# EAGLE design TBX01 (EAGLE 7.3.0)
CNAME: Test
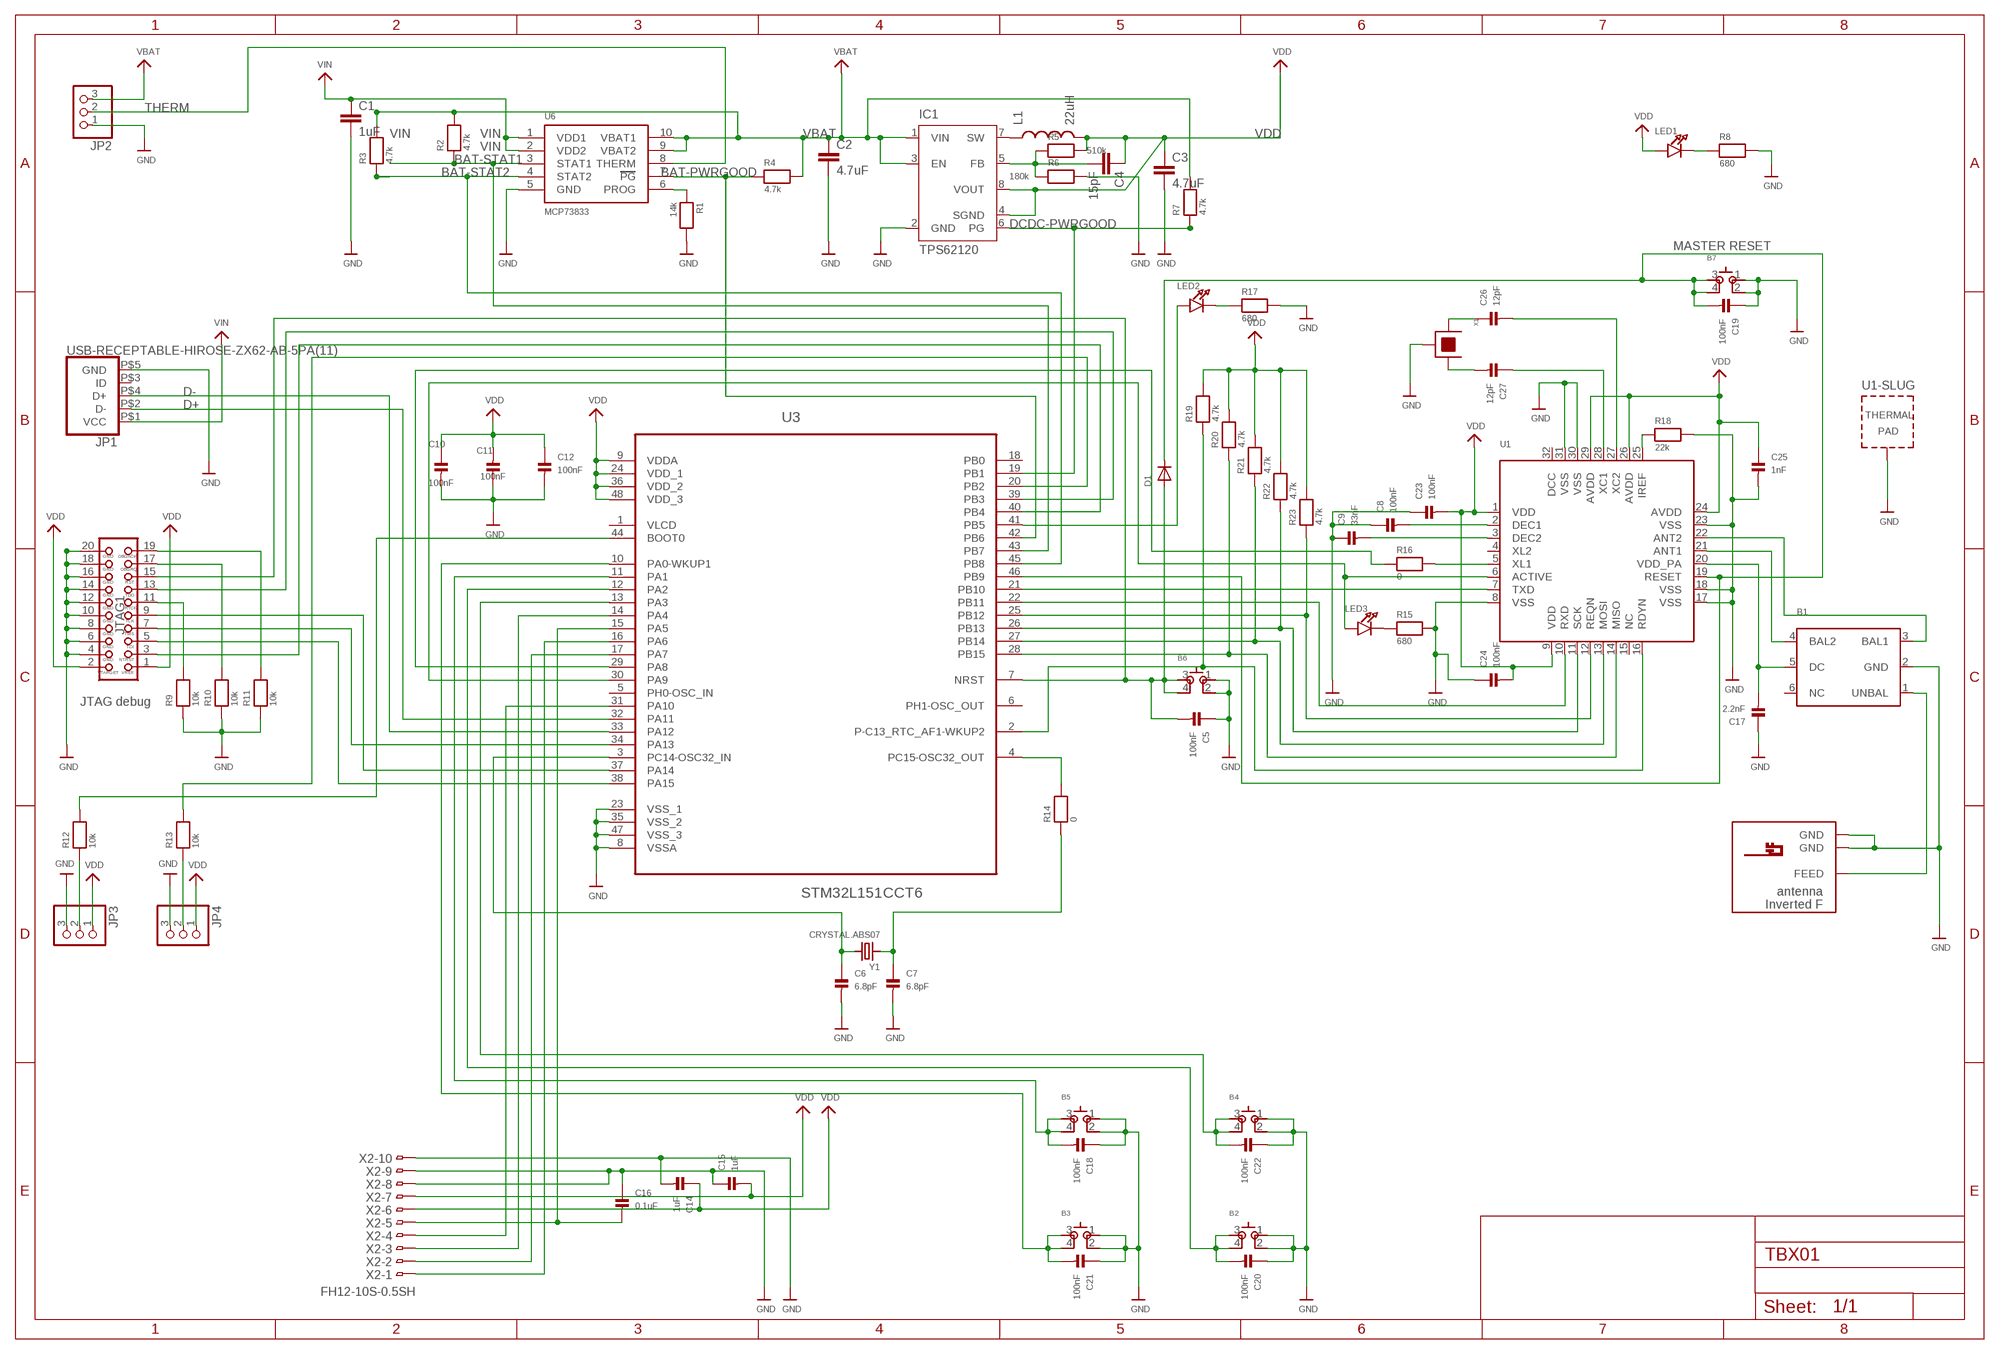
[diagram p0: schematic, sheet 1]

## Parts
B1  BALUN+LP_NORDIC  [BALUN0603]
B2  SKSCLDE010  [SKSCLDE010]
B3  SKSCLDE010  [SKSCLDE010]
B4  SKSCLDE010  [SKSCLDE010]
B5  SKSCLDE010  [SKSCLDE010]
B6  SKSCLDE010  [SKSCLDE010]
B7  SKSCLDE010  [SKSCLDE010]
C1  1uF  C-EUC0603  [C0603]
C2  4.7uF  C-EUC0603  [C0603]
C3  4.7uF  C-EUC0603  [C0603]
C4  15pF  C-EUC0603  [C0603]
C5  100nF  CAP_CERAMIC0603  [0603]
C6  6.8pF  CAP_CERAMIC0603  [0603]
C7  6.8pF  CAP_CERAMIC0603  [0603]
C8  100nF  CAP_CERAMIC0603  [0603]
C9  33nF  CAP_CERAMIC0603  [0603]
C10  100nF  CAP_CERAMIC0603  [0603]
C11  100nF  CAP_CERAMIC0603  [0603]
C12  100nF  CAP_CERAMIC0603  [0603]
C14  1uF  CAP_CERAMIC0603  [0603]
C15  1uF  CAP_CERAMIC0603  [0603]
C16  0.1uF  CAP_CERAMIC0603  [0603]
C17  2.2nF  CAP_CERAMIC0603  [0603]
C18  100nF  CAP_CERAMIC0603  [0603]
C19  100nF  CAP_CERAMIC0603  [0603]
C20  100nF  CAP_CERAMIC0603  [0603]
C21  100nF  CAP_CERAMIC0603  [0603]
C22  100nF  CAP_CERAMIC0603  [0603]
C23  100nF  CAP_CERAMIC0603  [0603]
C24  100nF  CAP_CERAMIC0603  [0603]
C25  1nF  CAP_CERAMIC0603  [0603]
C26  12pF  CAP_CERAMIC0603  [0603]
C27  12pF  CAP_CERAMIC0603  [0603]
D1  DIODESOD-123  [SOD-123]
IC1  TPS62120  [DCN-R-PDSO-G8]
JP1  USB-RECEPTABLE-HIROSE-ZX62-AB-5PA(11)  [HIROSE-ZX62-AB-5PA(11)]
JP2  HEADER-1X3ROUND  [1X03_ROUND]
JP3  HEADER-1X3ROUND  [1X03_ROUND]
JP4  HEADER-1X3ROUND  [1X03_ROUND]
JTAG1  JTAG-ARM  [JTAG-ARM]
L1  22uH  INDUCTOR1210  [1210]
LED1  LED0603  [CHIPLED_0603]
LED2  LED0603  [CHIPLED_0603]
LED3  LED0603  [CHIPLED_0603]
R1  14k  RESISTOR0603  [0603]
R2  4.7k  RESISTOR0603  [0603]
R3  4.7k  RESISTOR0603  [0603]
R4  4.7k  RESISTOR0603  [0603]
R5  510k  RESISTOR0603  [0603]
R6  180k  RESISTOR0603  [0603]
R7  4.7k  RESISTOR0603  [0603]
R8  680  RESISTOR0603  [0603]
R9  10k  RESISTOR0603  [0603]
R10  10k  RESISTOR0603  [0603]
R11  10k  RESISTOR0603  [0603]
R12  10k  RESISTOR0603  [0603]
R13  10k  RESISTOR0603  [0603]
R14  0  RESISTOR0603  [0603]
R15  680  RESISTOR0603  [0603]
R16  0  RESISTOR0603  [0603]
R17  680  RESISTOR0603  [0603]
R18  22k  RESISTOR0603  [0603]
R19  4.7k  RESISTOR0603  [0603]
R20  4.7k  RESISTOR0603  [0603]
R21  4.7k  RESISTOR0603  [0603]
R22  4.7k  RESISTOR0603  [0603]
R23  4.7k  RESISTOR0603  [0603]
U1  NRF8001  [QFN32_5MM]
U3  STM32L151CCT6  [QFP50P900X900X160-48N]
U6  MCP73833  [MSOP10]
U$44  INVERTED_F_ANTENNA+0  [DN007+0]
X1  SHIELDED_CRYSTALTSX-3225  [TSX-3225]
X2  FH12-10S-0.5SH  [FH12-10S-0.5SH]
Y1  CRYSTAL.ABS07  [ABS07]

## Nets
BAT-PWRGOOD: R4.1 U3.42(PB6) U6.7(PG)
BAT-STAT1: R2.1 U3.43(PB7) U6.3(STAT1)
BAT-STAT2: R3.1 U3.45(PB8) U6.4(STAT2)
D+: JP1.P$4(D+) U3.33(PA12)
D-: JP1.P$2(D-) U3.32(PA11)
DCDC-PWRGOOD: IC1.6(PG) R7.1 U3.19(PB1)
GND: B1.2(GND) B2.1 B2.2 B3.1 B3.2 B4.1 B4.2 B5.1 B5.2 B6.1 B6.2 B7.1 B7.2 C1.2 C2.2 C3.2 C5.1 C6.2 C7.2 C8.1 C9.1 C10.2 C11.1 C12.2 C14.2 C15.1 C16.1 C17.1 C18.1 C19.1 C20.1 C21.1 C22.1 C23.1 C24.1 C25.2 IC1.2(GND) JP1.P$5(GND) JP2.1 JP3.3 JP4.3 JTAG1.4 JTAG1.6 JTAG1.8 JTAG1.10 JTAG1.12 JTAG1.14 JTAG1.16 JTAG1.18 JTAG1.20 R1.2 R6.2 R8.2 R9.1 R10.1 R11.1 R15.2 R17.2 R18.2 U1.8(VSS) U1.17(VSS) U1.18(VSS) U1.23(VSS) U1.30(VSS) U1.31(VSS) U1.GND(TP) U3.8(VSSA) U3.23(VSS_1) U3.35(VSS_2) U3.47(VSS_3) U6.5(GND) U$44.GND U$44.GND@1(GND) X1.2 X1.4 X2.8 X2.9 X2.10
N$1: R1.1 U6.6(PROG)
N$2: LED1.C R8.1
N$3: C4.2 IC1.5(FB) R5.1 R6.1
N$4: IC1.7(SW) L1.1
N$5: JTAG1.3 U3.40(PB4)
N$6: JTAG1.13 U3.39(PB3)
N$7: JTAG1.5 U3.38(PA15)
N$8: JTAG1.7 U3.34(PA13)
N$9: JTAG1.9 U3.37(PA14)
N$10: B7.3 B7.4 C19.2 D1.C U1.19(RESET) U3.46(PB9)
N$11: JTAG1.11 R9.2
N$12: JTAG1.17 R10.2
N$13: JTAG1.19 R11.2
N$14: JP3.2 R12.1
N$15: JP4.2 R13.1
N$16: R12.2 U3.44(BOOT0)
N$17: R13.2 U3.20(PB2)
N$18: C6.1 U3.3(PC14-OSC32_IN) Y1.2
N$19: C8.2 U1.2(DEC1)
N$20: C9.2 U1.3(DEC2)
N$21: R14.2 U3.4(PC15-OSC32_OUT)
N$22: C7.1 R14.1 Y1.1
N$23: LED3.A U1.6(ACTIVE) U3.30(PA9)
N$24: C16.2 U3.15(PA5) X2.5
N$25: U3.31(PA10) X2.4
N$26: U3.14(PA4) X2.3
N$27: U3.17(PA7) X2.2
N$28: U3.16(PA6) X2.1
N$29: R16.1 U3.29(PA8)
N$30: U1.7(TXD) U3.21(PB10)
N$31: U1.10(RXD) U3.22(PB11)
N$32: R22.1 U1.11(SCK) U3.26(PB13)
N$33: R23.1 U1.12(REQN) U3.25(PB12)
N$34: R21.1 U1.13(MOSI) U3.27(PB14)
N$35: R20.1 U1.14(MISO) U3.28(PB15)
N$36: R19.1 U1.16(RDYN) U3.2(P-C13_RTC_AF1-WKUP2)
N$37: LED3.C R15.1
N$38: B3.3 B3.4 C21.2 U3.10(PA0-WKUP1)
N$39: R16.2 U1.5(XL1)
N$40: B5.3 B5.4 C18.2 U3.11(PA1)
N$41: B2.3 B2.4 C20.2 U3.12(PA2)
N$42: B4.3 B4.4 C22.2 U3.13(PA3)
N$43: LED2.A U3.41(PB5)
N$44: LED2.C R17.1
N$45: B1.4(BAL2) U1.21(ANT1)
N$46: B1.3(BAL1) U1.22(ANT2)
N$47: B1.1(UNBAL) U$44.FEED
N$48: B1.5(DC) C17.2 U1.20(VDD_PA)
N$49: R18.1 U1.25(IREF)
N$50: C26.1 X1.1
N$51: C27.2 X1.3
N$52: C27.1 U1.28(XC1)
N$53: C26.2 U1.27(XC2)
N$54: B6.3 B6.4 C5.2 D1.A JTAG1.15 U3.7(NRST)
THERM: JP2.2 U6.8(THERM)
VBAT: C2.1 IC1.1(VIN) IC1.3(EN) JP2.3 R2.2 R3.2 R4.2 R7.2 U6.9(VBAT2) U6.10(VBAT1)
VDD: C3.1 C4.1 C10.1 C11.2 C12.1 C14.1 C15.2 C23.2 C24.2 C25.1 IC1.4(SGND) IC1.8(VOUT) JP3.1 JP4.1 JTAG1.1 JTAG1.2 L1.2 LED1.A R5.2 R19.2 R20.2 R21.2 R22.2 R23.2 U1.1(VDD) U1.9(VDD) U1.24(AVDD) U1.26(AVDD) U1.29(AVDD) U3.9(VDDA) U3.24(VDD_1) U3.36(VDD_2) U3.48(VDD_3) X2.6 X2.7
VIN: C1.1 JP1.P$1(VCC) U6.1(VDD1) U6.2(VDD2)
Unconnected: B1.6(NC) JP1.P$3(ID) U1.4(XL2) U1.15(NC) U1.32(DCC) U3.5(PH0-OSC_IN) U3.6(PH1-OSC_OUT) U3.18(PB0)

## Notes on the sheet
- MASTER RESET
- JTAG debug

## Power pins joined to a net without a drawn wire
VLCD: U3.1(VLCD)

## Library data of the parts
B1 = microbuilder:BALUN+LP_NORDIC: Balun + Low Pass Filter 0603 Johanson 2450BM14A0002 (nRF8001) - 2400-2500 MHz Balun + Filter
B2-B7 = alps:SKSCLDE010
C1-C4 = rcl:C-EU: CAPACITOR, European symbol
C5-C12 C14-C27 = microbuilder:CAP_CERAMIC: Ceramic Capacitors 0402 - 0402 Surface Mount Capacitors 16pF 50V 5% [Digikey: 445-4899-2-ND] 18pF 50V 5% [Digikey: 490-1281-2-ND] 22pF 50V 5% [Digikey: 490-1283-2-ND] 68pF 50V 5% [Digikey: 490-1289-2-ND] 0.1uF 10V 10% [Digikey: 490-1318-2-ND] 1.0uF 6.3V 10% [Digikey: 490-1320-2-ND] 0603 - 0603 Surface Mount Capacitors 16 pF 50V 5% [Digikey: 445-5051-2-ND] 22 pF 50V [Digikey: PCC220ACVTR-ND] 33 pF 50V 5% [Digikey: 490-1415-1-ND] 56pF 50V 5% [Digikey: 490-1421-1-ND] 220pF 50V 5% [Digikey: 445-1285-1-ND] 680 pF 50V 2200 pF 50V 5% C0G [Digikey: 445-1297-1-ND] 5600 pF 100V 5% X7R [Digikey: 478-3711-1-ND] 0.1 µF 25V 10% [Digikey: PCC2277TR-ND] 0.22 µF 16V 10% X7R [Digikey: 445-1318-1-ND] 1.0 µF 25V 10% [Digikey: 445-5146-2-ND] 0603 - RF Specific 3pF 250V +/-0.1pF RF [Digikey: 712-1347-1-ND] 18 pF 250V 5% [Digikey: 478-3505-1-ND or 712-1322-1-ND] 56 pF 250V 5% C0G RF [Digikey: 490-4867-1-ND] 68 pF 250V RF [Digikey: 490-4868-1-ND] 0805 - 0805 Surface Mount Capacitors 220 pF 250V 2% RF Ceramic Capacitor [Digikey: 712-1398-1-ND] 1000 pF 50V 2% NP0 Ceramic Capacitor [Digikey: 478-3760-1-ND] 0.1 µF 25V 10% Ceramic Capacitor [Digikey: PCC1828TR-ND] 1.0 µF 16V 10% Ceramic Capacitor[Digikey: 490-1691-2-ND] 10.0 µF 10V 10% Ceramic Capacitor[Digikey: 709-1228-1-ND] 10.0 uF 16V 10% Ceramic Capacitor [Digikey: 478-5165-2-ND] 47 uF 6.3V 20% Ceramic Capacitor [Digikey: 587-1779-1-ND or 399-5506-1-ND] 1206 - 1206 Surface Mount Capacitors 47uF 10V 20% Ceramic Capacitor [Digikey: 490-5528-1-ND or 399-5508-1-ND or 445-6010-1-ND] 100uF 6.3V -20%, +80% Y5V Ceramic Capacitor (Digikey: 490-4512-1-ND, Mouser: 81-GRM31CF50J107ZE1L)
D1 = microbuilder:DIODE: Diode SMA Model Volts Amps Type Vf Vr Digikey # Notes SSA34-E3 40V 3A Schottky 480mV @ 3A 200uA @ 40V SSA34-E3/61TGITR-ND CDBA120-G 20V 1A Schottky 500mV @ 1A 500uA @ 20V 641-1014-6-ND REEL MBRA210 10V 2A Schottky 350mV @ 2A 700uA @ 10V MBRA210LT3 SOD-123 Model Volts Amps Type Vf Vr Order # Notes BAT54T1G 30V 200mA Schottky 800mV @ 200mA 2uA @ 25V BAT54T1GOSTR-ND B0530W 30V 500mA Schottky 430mV @ 500mA 130uA @ 30V B0530W-FDICT-ND REEL MBR120 1A 20V Schottky 340mV @ 1A MBR120VLSFT1GOSCT-ND SOD-323 Model Volts Amps Type Vf Vr Order # Notes PMEG2005EJ 20V 500mA Schottky 355mV @ 500mA 568-4110-1-ND ZLLS410 10V 570mA Schottky 380mV @ 570mA ZLLS410CT-ND 1N4148WS 75V 150mA Silicon/Simple 1V 1N4148WSFSCT-ND REEL SOD-523 Model Volts Amps Type Vf Vr Order # Notes BAT54XV2 30V 200mA Schottky 0.8V @ 100mA BAT54XV2CT-ND TB751S 30V 30mA Schottky RB751S-40TE61CT-ND SOT23-R/W (R = Solder Paste/Reflow Ovens, W = Hand-Soldering) Model Volts Amps Type Vf Vr Order # Notes BAT54FILM 40V 300mA Schottky 497-7162-1-ND
IC1 = texas:TPS62120: 15V, 75mA High Efficient Buck Converter Source: tps62120.pdf (www.ti.com)
JP1 = daspilker:USB-RECEPTABLE: USB Receptable
JP2-JP4 = microbuilder:HEADER-1X3: PIN HEADER
JTAG1 = microbuilder:JTAG-ARM: 20 Pin JTAG Connector For use with ARM7, and ARM9. Supported by some Cortex M3 boards with SWJ-DP interfaces (dual SWP/JTAG support). 4UConnector: 03556
L1 = SparkFun-Passives:INDUCTOR: Inductors Basic Inductor/Choke - 0603 and 1206. Footprints are not proven and vary greatly between part numbers. INDUCTOR POWER 3.3UH 4.0A SMD 0.197" L x 0.197" W x 0.177" H (5.00mm x 5.00mm x 4.50mm)
LED1-LED3 = microbuilder:LED: LED 0603 - 0603 Surface Mount Package 2mA: Green LED - Low Power (3.9mcd, 2ma, 1.7Vf) - Digikey: 475-2709-2-ND Orange LED - Low Power (9.8mcd, 2ma, 1.8Vf) - Digikey: 475-1194-2-ND Red LED - Low Power (5mcd, 2ma, 1.8Vf) - Digikey: 475-1195-2-ND Yellow LED - Low Power (7mcd, 2ma, 1.8Vf) - Digikey: 475-1196-2-ND 5mA: Blue LED - Low Power (17mcd, 5ma, 2.9Vf) - Digikey: LNJ937W8CRACT-ND 0805 - 0805 Surface Mount Package 2mA: Red LED (8.8mcd, 2mA, 1.8Vf, Clear) - Low Power [Digikey: 475-2510-1-ND] Green LED (5mcd, 2mA, 1.8Vf, Clear) - Low Power [Digikey: 475-2730-1-ND] Yellow LED (11.3mcd, 2mA, 1.8Vf, Clear) - Low Power [Digikey: 475-2555-1-ND] 20mA: Red LED (104mcd, 20mA, Diffused) - LS R976 [Digikey: 475-1278-6-ND] Red LED (12mcd, 20mA, 2.0Vf, Clear) - APT2012EC [Digikey: 754-1128-1-ND] Green LED (15mcd, 20mA, 2.2Vf, Clear) - APT2012GC [Digikey: 754-1131-1-ND] Orange LED (160mcd, 20mA, 2.1Vf, Clear) - APT2012SECK [Digikey: 754-1130-1-ND] 1206 - 1206 Surface Mount Package Green LED (26mcd, 20mA, Diffused) - LG N971 [Digikey: 475-1407-6-ND] Red LED (15mcd, 20mA, Diffused) - LH N974 [Digikey: 475-1416-6-ND]
R1-R23 = microbuilder:RESISTOR: Resistors 0402 - 0402 Surface Mount Package 22 Ohm 1% 1/16W [Digikey: 311-22.0LRTR-ND] 33 Ohm 5% 1/16W 1.0K 5% 1/16W 1.5K 5% 1/16W 2.0K 1% 1/16W 10.0K 1% 1/16W [Digikey: 311-10.0KLRTR-ND] 10.0K 5% 1/16W [Digikey: RMCF0402JT10K0TR-ND] 12.1K 1% 1/16W [Digikey: 311-22.0LRTR-ND] 100.0K 5% 1/16W 0603 - 0603 Surface Mount Package 0 Ohm 1/10 Watt 1% Resistor 15 Ohm 1/10 Watt 1% Resistor 33 Ohm 1/10 Watt 1% Resistor 49.9 Ohm 1/10 Watt 1% Resistor 100 Ohm 1/10 Watt 1% Resistor 150 Ohm 1/10 Watt 1% Resistor 240 Ohm 1/10 Watt 1% Resistor 390 Ohm 1/10 Watt 1% Resistor 560 Ohm 1/10 Watt 1% Resistor 680 Ohm 1/10 Watt 1% Resistor 750 Ohm 1/10 Watt 1% Resistor 1.0K Ohm 1/10 Watt 1% Resistor 1.5K Ohm 1/10 Watt 1% Resistor 2.0K Ohm 1/10 Watt 1% Resistor 2.2K Ohm 1/10 Watt 1% Resistor 3.3K Ohm 1/10 Watt 1% Resistor 4.7K Ohm 1/10 Watt 1% Resistor 10.0K Ohm 1/10 Watt 1% Resistor 12.0K Ohm 1/10 Watt 1% Resistor 12.1K Ohm 1/10 Watt 1% Resistor 20.0K Ohm 1/10 Watt 1% Resistor 33.0K Ohm 1/10 Watt 1% Resistor 100.0K Ohm 1/10 Watt 1% Resistor 0805 - 0805 Surface Mount Package 0 Ohm 1/8 Watt 1% Resistor 33 Ohm 1/8 Watt 1% Resistor 100 Ohm 1/8 Watt 1% Resistor 150 Ohm 1/8 Watt 1% Resistor 200 Ohm 1/8 Watt 1% Resistor 240 Ohm 1/8 Watt 1% Resistor 330 Ohm 1/8 Watt 1% Resistor 390 Ohm 1/8 Watt 1% Resistor 470 Ohm 1/8 Watt 1% Resistor 1.0K Ohm 1/8 Watt 1% Resistor 1.5K Ohm 1/8 Watt 1% Resistor 2.0K Ohm 1/8 Watt 1% Resistor 4.7K Ohm 1/8 Watt 1% Resistor 5.1K Ohm 1/8 Watt 1% Resistor 5.6K Ohm 1/8 Watt 1% Resistor 10.0K Ohm 1/8 Watt 1% Resistor 22.0K Ohm 1/8 Watt 1% Resistor 33.0K Ohm 1/8 Watt 1% Resistor 100K Ohm 1/8 Watt 1% Resistor 1206 - 1206 Surface Mount Package 2012 - 2010 Surface Mount Package 0.11 Ohm 1/2 Watt 1% Resistor - Digikey: RHM.11UCT-ND
U1 = microbuilder:NRF8001: nRF8001 - Bluetooth Low-Energy Transceiver VDD: 1.9-3.6V Temp: -40°C - 85°C
U3 = ST Microelctronics_By_element14_Batch_1:STM32L151CCT6: ARM-based 32-bit MCU; MPN: STM32L151CBT6; OC_FARNELL: 2333386; OC_NEWARK: 99W9944; PACKAGE: LQFP-48; SUPPLIER: STMICROELECTRONICS
U6 = microbuilder:MCP73833: Lithium-Polymer/Lithium-Ion Battery Charger [Part No.] Microchip MCP73833 MSOP10 (tube only): Digikey: MCP73833T-AMI/UN or MCP73833-FCI/UN-ND Mouser: 579-MCP73833-AMI/UN DFN10 (tape): Digikey: Note Chips ending in 'AMI' have no timer, and chips ending in 'FCI' have a 6-hour timer that will end the charge sequence after 6 horus regqrdless of current charge level.
U$44 = TI_antenna:INVERTED_F_ANTENNA: 2.4GHz Inverted F Antenna Based on TI Design Note DN007
X1 = PP_FreqCtrl:SHIELDED_CRYSTAL
X2 = con-hirose:FH12-10S-0.5S: 0.5mm Pitch Connectors For FPC/FFC Source: Data sheet <http://www.hirose.co.jp/cataloge_hp/e58605370.pdf>; MPN: FH12-10S-0.5SH(55); OC_FARNELL: 1324540; OC_NEWARK: 34M6152
Y1 = abracon:CRYSTAL

## Board
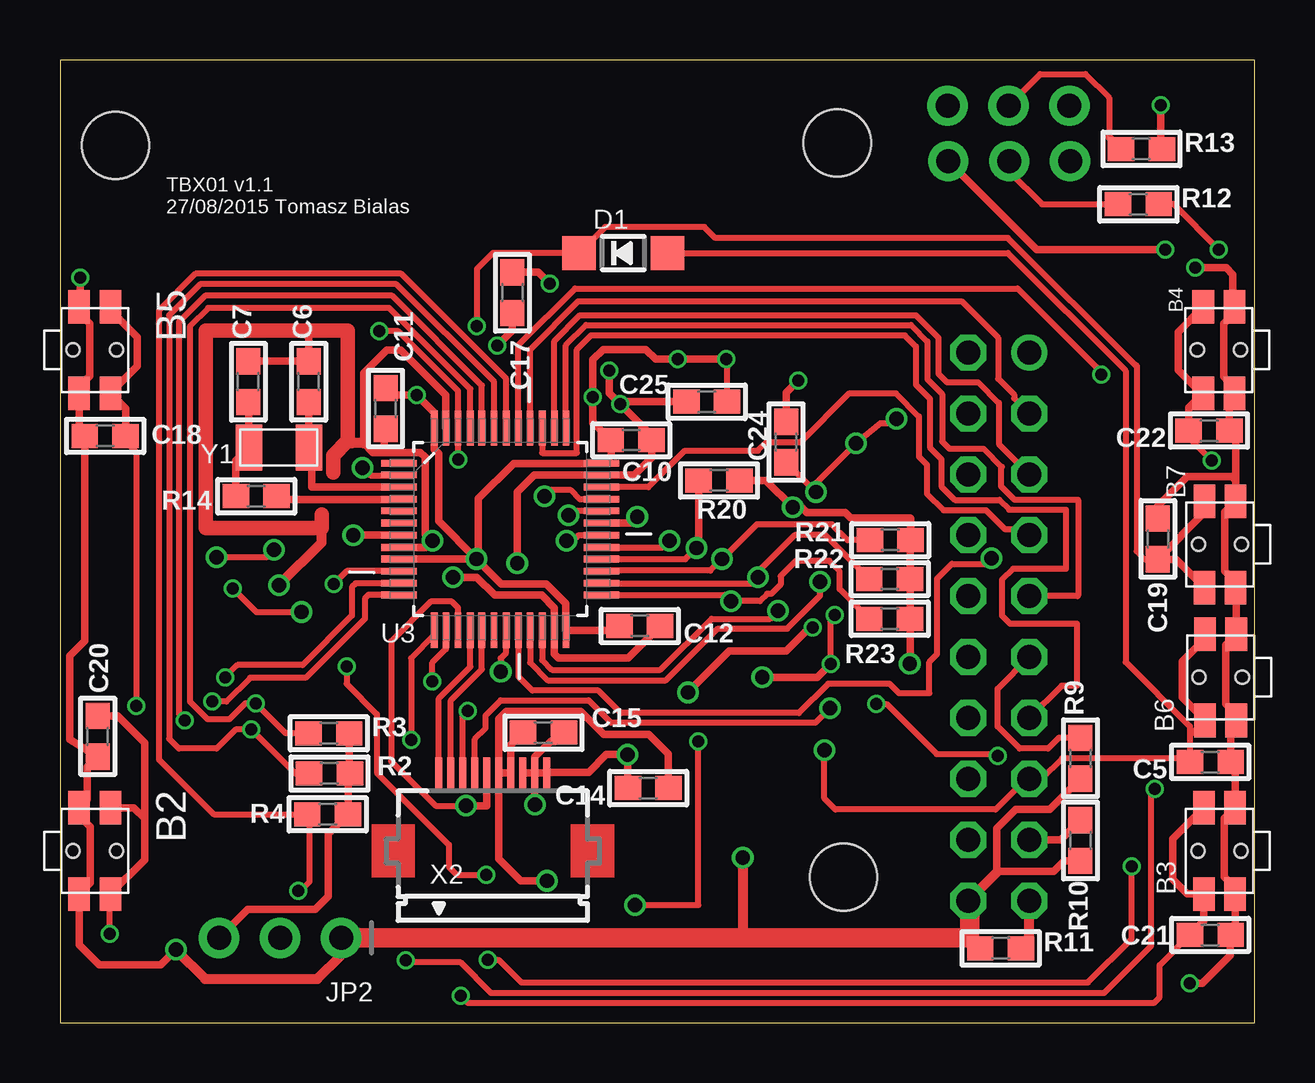
[diagram p1: board, top side]
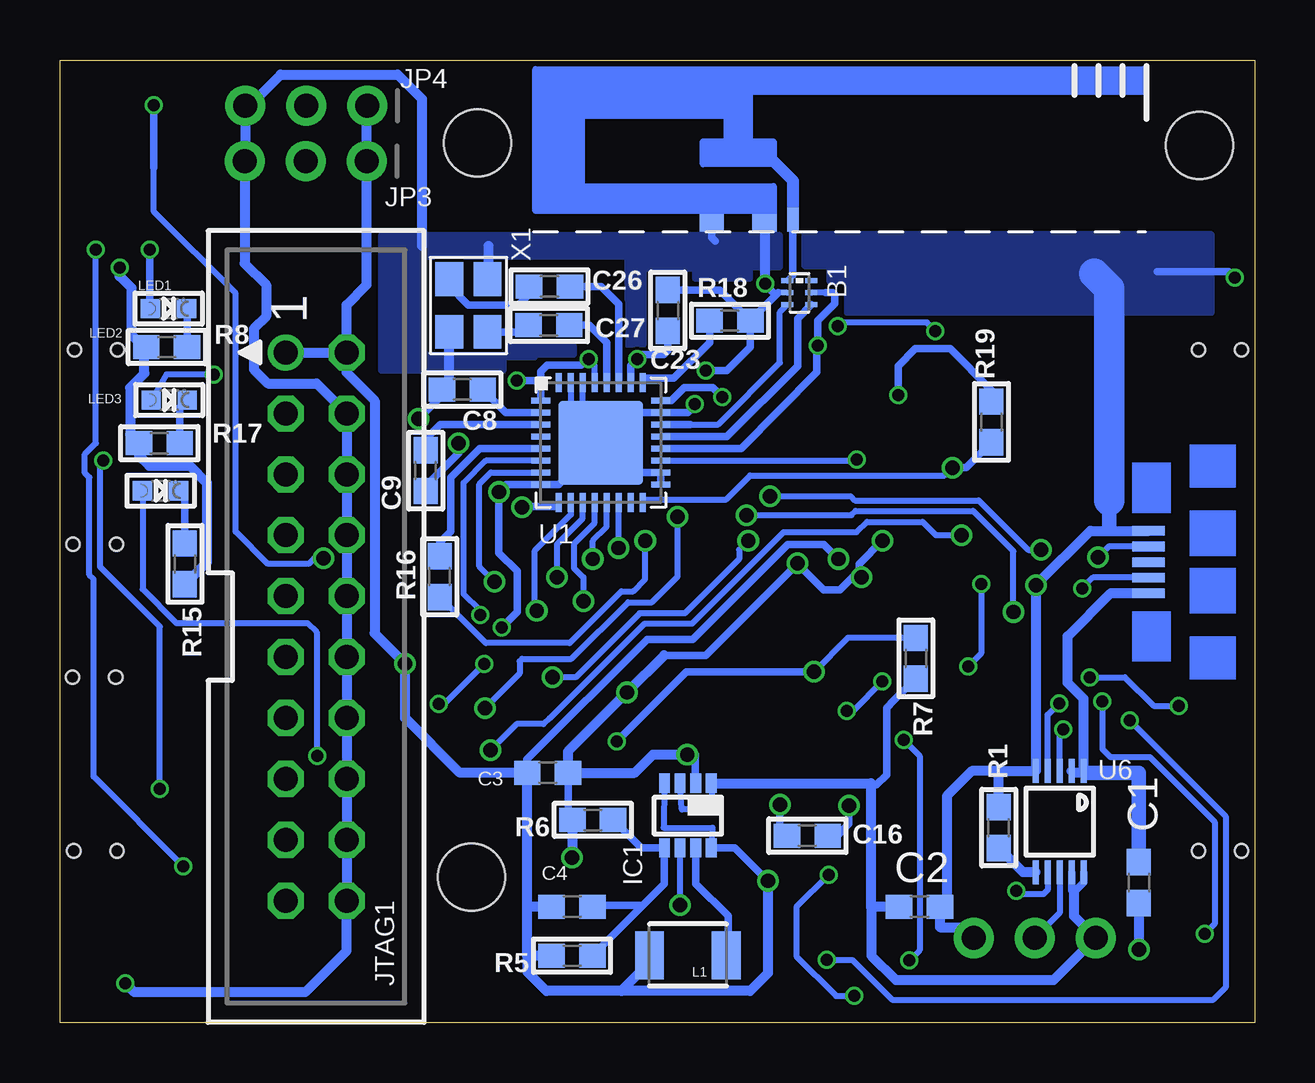
[diagram p2: board, bottom side, seen from below]

Size 49.78 x 40.13 mm. Coordinates in mm from the lower left corner, seen from the top.
Outline: 0,0 49.78,0 49.78,40.13 0,40.13 0,0
Copper layers (1*16): Top 0.018mm / dielectric 1.55mm / Bottom 0.018mm
Design rules "eC_2Layer_PClass7_BaseCopperO18": minimum track width 0.125mm, minimum drill 0.35mm, track to track 0.125mm, track to pad 0.125mm, pad to pad 0.125mm, via to via 0.125mm, smd to smd 0mil, copper to edge 0.25mm, drill to drill 0.35mm, minimum pad ring 0.175mm, minimum via ring 0.125mm, stop-mask expansion 0mil, vias tented up to drill 0.45mm, thermal gap 0.2mm
Holes 2.8 mm at 32.38,36.68 2.31,36.58 32.64,6.07

### Footprints (pad centres in the part's own frame; a part is rotated, then mirrored left to right if it is on the bottom)
BALUN0603 = smd 0.2 x 0.5: 1 0.5,0.5; 2 0,0.5; 3 -0.5,0.5; 4 -0.5,-0.5; 5 0,-0.5; 6 0.5,-0.5
SKSCLDE010 = smd 1.4 x 0.9: 1 -1.8,-0.65; 2 1.8,-0.65; 3 -1.8,0.65; 4 1.8,0.65 | hole 0.55: 0,0.9; 0,-0.9
C0603 = smd 1.1 x 1: 1 -0.85,0; 2 0.85,0
0603 = smd 1.1 x 1: 1 -0.85,0; 2 0.85,0
SOD-123 = smd 1.4 x 1.4: A 1.85,0; C -1.85,0
DCN-R-PDSO-G8 = smd 0.45 x 0.8: 1 -0.975,-1.35; 2 -0.325,-1.35; 3 0.325,-1.35; 4 0.975,-1.35; 5 0.975,1.35; 6 0.325,1.35; 7 -0.325,1.35; 8 -0.975,1.35
HIROSE-ZX62-AB-5PA(11) = smd 0.4 x 1.35 bottom: P$1 1.3,4.125; P$2 0.65,4.125; P$3 0,4.125; P$4 -0.65,4.125; P$5 -1.3,4.125
1X03_ROUND = drill 1 pad 1.676: 1 -2.54,0; 2 0,0; 3 2.54,0
JTAG-ARM = drill 1: 1 -11.43,-1.27 | drill 1 octagon: 2 -11.43,1.27; 3 -8.89,-1.27; 4 -8.89,1.27; 5 -6.35,-1.27; 6 -6.35,1.27; 7 -3.81,-1.27; 8 -3.81,1.27; 9 -1.27,-1.27; 10 -1.27,1.27; 11 1.27,-1.27; 12 1.27,1.27; 13 3.81,-1.27; 14 3.81,1.27; 15 6.35,-1.27; 16 6.35,1.27; 17 8.89,-1.27; 18 8.89,1.27; 19 11.43,-1.27; 20 11.43,1.27
1210 = smd 1.2 x 2: 1 -1.6,0; 2 1.6,0
CHIPLED_0603 = smd 0.8 x 0.8: A 0,-0.75; C 0,0.75
QFN32_5MM = smd 0.8 x 0.25: 1 -2.5,1.75; 2 -2.5,1.25; 3 -2.5,0.75; 4 -2.5,0.25; 5 -2.5,-0.25; 6 -2.5,-0.75; 7 -2.5,-1.25; 8 -2.5,-1.75; 17 2.5,-1.75; 18 2.5,-1.25; 19 2.5,-0.75; 20 2.5,-0.25; 21 2.5,0.25; 22 2.5,0.75; 23 2.5,1.25; 24 2.5,1.75 | smd 0.25 x 0.8: 9 -1.75,-2.5; 10 -1.25,-2.5; 11 -0.75,-2.5; 12 -0.25,-2.5; 13 0.25,-2.5; 14 0.75,-2.5; 15 1.25,-2.5; 16 1.75,-2.5; 25 1.75,2.5; 26 1.25,2.5; 27 0.75,2.5; 28 0.25,2.5; 29 -0.25,2.5; 30 -0.75,2.5; 31 -1.25,2.5; 32 -1.75,2.5 | smd 3.5 x 3.5: GND 0,0
QFP50P900X900X160-48N = smd 1.473 x 0.279: 1 -4.216,2.743; 2 -4.216,2.261; 3 -4.216,1.753; 4 -4.216,1.245; 5 -4.216,0.762; 6 -4.216,0.254; 7 -4.216,-0.254; 8 -4.216,-0.762; 9 -4.216,-1.245; 10 -4.216,-1.753; 11 -4.216,-2.261; 12 -4.216,-2.743; 25 4.216,-2.743; 26 4.216,-2.261; 27 4.216,-1.753; 28 4.216,-1.245; 29 4.216,-0.762; 30 4.216,-0.254; 31 4.216,0.254; 32 4.216,0.762; 33 4.216,1.245; 34 4.216,1.753; 35 4.216,2.261; 36 4.216,2.743 | smd 0.279 x 1.473: 13 -2.743,-4.216; 14 -2.261,-4.216; 15 -1.753,-4.216; 16 -1.245,-4.216; 17 -0.762,-4.216; 18 -0.254,-4.216; 19 0.254,-4.216; 20 0.762,-4.216; 21 1.245,-4.216; 22 1.753,-4.216; 23 2.261,-4.216; 24 2.743,-4.216; 37 2.743,4.216; 38 2.261,4.216; 39 1.753,4.216; 40 1.245,4.216; 41 0.762,4.216; 42 0.254,4.216; 43 -0.254,4.216; 44 -0.762,4.216; 45 -1.245,4.216; 46 -1.753,4.216; 47 -2.261,4.216; 48 -2.743,4.216
MSOP10 = smd 0.25 x 1: 1 -1,-2.113; 2 -0.5,-2.113; 3 0,-2.113; 4 0.5,-2.113; 5 1,-2.113; 6 1,2.113; 7 0.5,2.113; 8 0,2.113; 9 -0.5,2.113; 10 -1,2.113
DN007+0 = smd 0.46 x 1: FEED 2.22,-2.8 | smd 1.01 x 0.74: GND -1.16,-2.93; GND@1 1.035,-2.93
TSX-3225 = smd 1.4 x 1.15: 1 -1.1,-0.8; 2 1.1,-0.8; 3 1.1,0.8; 4 -1.1,0.8
FH12-10S-0.5SH = smd 0.3 x 1.3: 1 -2.25,3.25; 2 -1.75,3.25; 3 -1.25,3.25; 4 -0.75,3.25; 5 -0.25,3.25; 6 0.25,3.25; 7 0.75,3.25; 8 1.25,3.25; 9 1.75,3.25; 10 2.25,3.25
ABS07 = smd 1.1 x 1.9: 1 -1.25,0; 2 1.25,0

### Placement (x,y rotation side)
B1  18.97,30.43 90 bottom
B2  1.45,7.16 270 top
B3  48.31,7.16 90 top
B4  48.29,28.04 90 top
B5  1.45,28.04 270 top
B6  48.36,14.4 90 top
B7  48.34,19.94 90 top
C1  4.83,5.84 270 bottom
C2  13.97,4.83 0 bottom
C3  29.46,10.41 0 bottom
C4  28.45,4.83 0 bottom
C5  47.93,10.87 180 top
C6  10.36,26.72 90 top
C7  7.85,26.72 90 top
C8  33.02,26.39 0 bottom
C9  34.54,23.01 90 bottom
C10  23.8,24.28 0 top
C11  13.56,25.6 90 top
C12  24.16,16.54 0 top
C14  24.51,9.78 180 top
C15  20.14,12.09 180 top
C16  18.64,7.8 0 bottom
C17  18.85,30.43 270 top
C18  1.88,24.46 0 top
C19  45.75,20.17 270 top
C20  1.57,11.94 90 top
C21  47.93,3.66 180 top
C22  47.88,24.69 180 top
C23  24.46,29.69 270 bottom
C24  30.25,24.21 90 top
C25  26.95,25.88 180 top
C26  29.39,30.68 0 bottom
C27  29.41,29.08 180 bottom
D1  23.47,32.08 0 top
IC1  23.62,8.64 180 bottom
JP1  0.3,19.2 270 top
JP2  9.17,3.53 180 top
JP3  39.55,35.92 180 bottom
JP4  39.52,38.23 180 bottom
JTAG1  39.12,16.51 270 bottom
L1  23.62,2.82 180 bottom
LED1  45.26,29.77 270 bottom
LED2  45.24,25.96 270 bottom
LED3  45.59,22.17 270 bottom
R1  10.67,8.13 90 bottom
R2  11.23,10.39 0 top
R3  11.2,12.06 0 top
R4  11.15,8.69 0 top
R5  28.45,2.79 180 bottom
R6  27.58,8.46 180 bottom
R7  14.12,15.19 270 bottom
R8  45.34,28.17 180 bottom
R9  42.52,11.02 90 top
R10  42.52,7.59 90 top
R11  39.19,3.1 0 top
R12  44.93,34.11 0 top
R13  45.06,36.42 0 top
R14  8.18,21.95 0 top
R15  44.58,19.13 270 bottom
R16  33.96,18.59 90 bottom
R17  45.64,24.16 180 bottom
R18  21.87,29.26 0 bottom
R19  10.97,25.04 90 bottom
R20  27.46,22.61 0 top
R21  34.59,20.12 0 top
R22  34.57,18.49 0 top
R23  34.57,16.84 0 top
U1  27.25,24.18 0 bottom
U3  18.34,20.57 0 top
U6  8.13,8.38 180 bottom
U$44  21.46,36.27 0 bottom
X1  32.77,29.9 270 bottom
X2  18.03,7.16 0 top
Y1  9.12,23.98 0 top

### Tracks (layer width: path | path; a pad name or v marks a point on that pad's centre or on a via)
BAT-PWRGOOD  (via drill 0.5)
  Top 0.254: U3.42 18.59,26.85 14.22,31.22 5.64,31.22 4.12,29.69 4.12,10.97 6.4,8.69 R4.1 | 10.31,8.69 R4.1 | v9.93,5.49 10.01,5.49 10.4,5.88 10.4,8.59 R4.1
  Bottom 0.254: U6.7 8.61,6.25 8.61,5.56 8.81,5.36 9.8,5.36 v9.93,5.49
BAT-STAT1  (via drill 0.5)
  Top 0.254: U3.43 18.09,26.72 14.02,30.79 5.84,30.79 4.55,29.49 4.55,11.84 4.95,11.43 6.53,11.43 7.32,12.22 v7.98,12.22 9.8,10.39 R2.1
  Bottom 0.254: U6.3 8.13,12.06 v7.98,12.22
BAT-STAT2  (via drill 0.5)
  Top 0.254: U3.45 17.09,26.42 13.72,29.79 6.17,29.79 5.41,29.03 5.41,13.39 6.15,12.65 7.06,12.65 7.72,13.31 v8.15,13.31 9.4,12.06 R3.1
  Bottom 0.254: U6.4 8.63,12.84 v8.15,13.31
D+  (via drill 0.6)
  Top 0.254: U3.33 21.67,21.82 21.29,22.2 20.45,22.2 v20.19,21.95 | v6.53,19.41 8.61,19.41 v8.91,19.71
  Bottom 0.254: v20.19,21.95 16.84,21.95 16.66,21.77 11.51,21.77 9.45,19.71 v8.91,19.71 | JP1.P$4 6.08,19.85 v6.53,19.41
D-  (via drill 0.5, 0.6)
  Top 0.254: U3.32 21.36,21.34 v21.18,21.16 | v7.19,18.11 8.18,17.12 v10.06,17.12
  Bottom 0.254: v21.18,21.16 16.82,21.16 16.64,21.34 11.73,21.34 10.06,19.66 v10.06,17.12 | JP1.P$2 6.75,18.55 v7.19,18.11
DCDC-PWRGOOD  (via drill 0.5, 0.6)
  Top 0.254: U3.19 18.59,15.42 18.36,15.19 v18.36,14.63 | v26.59,11.73 26.59,4.9 v23.95,4.9
  Bottom 0.254: v23.95,4.9 IC1.6 | v18.36,14.63 16.95,16.04 R7.1
  Bottom 0.305: v18.36,14.63 23.7,14.63 v26.59,11.73
GND  (via drill 0.5, 0.6)
  Top 0.254: v34.85,25.17 34.67,24.99 34.19,24.99 v33.17,24.16 31.5,22.48 v31.5,22.12 30.33,23.29 30.25,23.29 C24.1 | R9.1 42.52,10.13 | 41.4,6.3 41.38,6.27 | 0.78,24.71 C18.1
  Top 0.305: X2.9 X2.10 20.31,10.44 22.02,10.44 22.76,11.18 v23.65,11.18 23.65,9.79 C14.2 | U3.8 15.24,19.81 v15.52,20.09 15.27,20.34 15.21,20.34 15.21,23.57 15.01,23.77 13.51,23.77 | v16.38,18.57 17.37,18.57 18.11,17.83 20.07,17.83 20.6,17.3 U3.23 20.6,15.37 20.75,15.21 23.68,15.21 C12.2 | C10.2 24.66,24.19 | X2.8 X2.9 | X2.9 v19.79,9.09 | C15.1 20.64,11.73 20.45,11.73 19.78,11.07 X2.9 | v19.05,19.15 19.05,22.12 19.76,22.84 U3.35 23.93,22.84 24.65,23.56 C10.2 | C7.2 C6.2 10.36,28.55 10.06,28.85 | 23.42,25.86 v23.34,25.78 | U3.47 16.08,26.16 14.2,28.04 13.61,28.04 12.65,27.08 12.65,24.16 13.03,23.77 13.51,23.77 | C25.2 23.44,25.88 v23.34,25.78 | v22.89,27.18 22.89,26.24 v23.34,25.78 | C10.2 24.73,24.4 | v31.37,16.48 31.24,16.48 30.25,15.49 27.89,15.49 v26.16,13.77 | B7.2 48.94,21.79 | v47.3,31.47 48.59,31.47 48.87,31.19 48.87,29.91 B4.2 48.94,29.58 48.49,29.13 48.49,26.92 48.64,26.77 48.64,26.54 B4.1 | B4.1 48.99,26.19 | B7.2 48.54,21.29 48.54,18.82 48.99,18.38 B7.1 49.01,18.11 B6.2 48.56,15.76 48.56,13.28 49.01,12.84 B6.1 48.78,12.37 C5.1 48.96,10.69 B3.2 48.51,8.52 48.51,6.07 48.96,5.62 B3.1 48.96,3.84 C21.1 48.77,3.65 48.77,2.82 47.6,1.65 v47.07,1.65 | 45.92,21.2 C19.1 45.74,21.54 46.97,22.76 48.82,22.76 48.99,22.59 B7.2 | 0.78,26.22 B5.2 | B5.2 0.8,26.5 1.25,26.95 1.25,29.13 0.8,29.58 B5.1 0.84,29.88 v0.84,31.06 | 0.78,24.71 0.8,24.74 B5.2 | 48.99,24.46 C22.1 | C22.1 48.99,24.25 B7.2 | C18.1 1.03,15.91 0.41,15.29 0.41,11.8 C20.1 1.14,10.66 1.14,9.31 B2.1 0.8,8.63 1.27,8.15 1.27,5.83 B2.2 0.8,3.24 1.63,2.41 4.19,2.41 v4.83,3.05 | R9.1 41.24,8.89 39.83,8.89 39.04,8.1 39.04,6.27 39.06,6.3 41.4,6.3 41.85,6.75 R10.1
  Top 0.305: C10.2 24.65,24.47 v23.34,25.78 | C17.1 19.93,31.28 v20.4,30.81 | C11.1 13.51,24.75 13.51,23.77 | B4.1 48.73,26.24 C22.1 | 10.9,20.62 10.9,20.7 10.92,20.73
  Top 0.406: X2.10 | 37.91,3.53 37.9,3.53 37.9,3.61 | 12.65,24.16 12.17,24.16 11.99,24.33 | R10.1 42.52,6.83 42.47,6.88 | v4.83,3.05 6.04,1.83 10.72,1.83 11.71,2.82 JP2.1 | 39.04,6.27 JTAG1.20 37.9,5.03 37.9,4.95 37.9,3.61 | R11.1 38.08,3.1 37.85,3.33 37.85,3.56 37.9,3.61 | v28.45,6.88 28.45,3.53 | 10.9,20.62 10.9,20.02 v9.12,18.24
  Top 0.61: 11.38,22.94 11.38,23.65 11.99,24.26 11.99,24.33 11.99,28.85 10.06,28.85 6.07,28.85 6.07,20.62 10.9,20.62 10.9,21.18
  Top 0.813: JP2.1 37.67,3.53 | 37.67,3.53 37.82,3.53 37.85,3.56 | 37.9,4.95 37.9,3.76 37.67,3.53
  Bottom 0.254: 16.48,18.67 v16.38,18.57 | 34.84,22.16 C9.1 34.31,22.39 34.31,22.61 | v34.85,25.17 34.78,25.17 | B1.2 19.85,30.43 | 28,24.93 28,25.25 | 28,25.25 U1.30 | U1.31 28.5,25.75 28,25.25
  Bottom 0.305: IC1.2 23.32,9.99 23.32,11.18 v23.65,11.18 | R6.2 28.61,8.64 C3.2 | v15.52,20.09 16.48,19.13 16.48,18.67 16.66,18.67 17.3,18.03 17.96,18.03 19.05,19.13 v19.05,19.15 22.89,15.32 24.61,15.32 | 28.6,10.43 C3.2 | v19.79,9.09 19.79,8.09 C16.1 | 37.42,22.43 JTAG1.6 | U1.17 U1.18 26,22.93 U1.GND | v23.34,25.78 23.34,25.7 23.62,25.43 U1.23 25.78,25.43 25.78,24.18 U1.GND | 19.85,30.43 19.96,30.32 | 19.96,30.32 R18.2 | R18.2 21.02,28.16 22,27.18 v22.89,27.18 | C23.1 22.3,30.54 R18.2 | v20.4,30.81 20.4,30.79 20.4,30.76 19.96,30.32 | v31.37,16.48 30.73,17.12 30.73,18.82 31.5,19.58 v31.5,22.12 31.19,22.43 U1.8 29,22.43 U1.GND | 28.63,10.43 C3.2 | C8.1 33.87,26.15 v34.85,25.17 | v0.84,31.06 1.09,31.32 4.06,31.32 | U$44.GND 22.62,32.73 22.48,32.59 | 28,24.93 U1.GND | v33.17,24.16 33.17,23.75 34.31,22.61
  Bottom 0.406: JTAG1.18 JTAG1.16 JTAG1.14 JTAG1.12 JTAG1.10 JTAG1.8 JTAG1.6 JTAG1.4 39.09,26.64 41.12,26.64 41.71,27.23 41.71,28.93 41.2,29.44 41.2,30.76 42.09,31.65 JP3.3 42.06,35.94 JP4.3 41.88,38.23 40.59,39.52 35.71,39.52 34.7,38.51 34.7,32.38 | 37.87,7.59 JTAG1.18 | C1.2 v4.83,3.05 | R1.2 10.67,10.49 | 10.67,10.49 11.79,10.49 12.83,9.45 12.83,5.12 C2.2 13.12,3.98 12.15,3.98 JP2.1 | 10.67,10.49 U6.5 9.12,10.51 v9.12,18.24 6.85,20.5 JP1.P$5 | C3.2 25.83,10.41 25.07,11.18 v23.65,11.18 | 28.63,10.43 28.63,11.3 v26.16,13.77 24.61,15.32 | C8.1 33.57,26.39 X1.2 | X1.4 31.93,31 31.93,32.38 | v47.07,1.65 46.69,1.27 39.57,1.27 37.85,3 JTAG1.20 JTAG1.18 | v47.3,31.47 47.3,31.11 46.81,30.63 46.81,28.69 46.29,28.17 R8.2 46.27,28.09 46.27,27.07 46.86,26.47 46.86,24.52 R17.2 46.49,23.63 46.08,23.22 44.37,23.22 43.66,22.5 43.66,19.19 R15.2 | R6.2 28.45,8.46 v28.45,6.88 | 20.4,30.79 20.4,33.31 U$44.GND@1
  Bottom 0.61: 6.07,21.77 6.07,20.62
  Bottom 1.27: 6.07,21.77 6.07,30.61 6.68,31.22
  pour Bottom (no thermals): 19.81,32.82 36.37,32.82 36.37,27.2 31.34,27.2 31.34,27.51 31.34,27.74 31.34,27.76 30.02,27.76 30.02,27.86 28.4,27.86 28.4,28.19 31.09,28.19 31.09,27.81 34.62,27.81 34.62,31.95 26.11,31.95 26.11,28.27 25.5,28.27 25.5,31.45 23.29,31.45 23.29,31.04 21.06,31.04 21.06,31.52 19.81,31.52
  pour Bottom (no thermals): 18.77,32.87 18.77,31.55 17.73,31.55 17.73,30.91 16.99,30.91 16.99,29.59 1.8,29.59 1.8,32.87
N$1
  Bottom 0.406: U6.6 9.66,6.27 R1.1
N$2
  Bottom 0.254: LED1.C 44.56,29.72
  Bottom 0.305: R8.1 44.49,29.75 LED1.C
N$3
  Bottom 0.305: R5.1 25.5,4.9 | 25.5,4.9 24.6,5.79 IC1.5 25.56,7.29 R6.1 | C4.2 27.53,4.9 25.5,4.9
N$4
  Bottom 0.305: IC1.7 23.3,5.8 21.95,4.45 21.95,2.36 L1.1
N$5
  Top 0.254: JTAG1.3 39.75,26.04 39.75,26.19 39.09,26.85 39.09,28.55 37.57,30.07 21.59,30.07 19.58,28.07 U3.40
N$6
  Top 0.254: JTAG1.13 41.73,14.05 42.37,14.05 42.37,16.64 39.57,16.64 39.24,16.97 39.24,18.47 39.7,18.92 41.91,18.92 41.91,21.39 39.55,21.39 39.14,21.79 37.29,21.79 36.73,22.35 36.73,23.5 36.25,23.98 36.25,26.01 35.66,26.59 35.66,28.19 35.2,28.65 22.12,28.65 21.54,28.07 21.54,23.75 20.09,23.75 U3.39
N$7
  Top 0.254: JTAG1.5 39.12,24.13 39.12,25.83 38.25,26.7 36.96,26.7 36.6,27.05 36.6,28.55 35.66,29.49 21.67,29.49 20.6,28.42 U3.38
N$8
  Top 0.254: JTAG1.7 40.13,20.57 39.37,20.57 38.58,21.36 36.8,21.36 36.12,22.05 36.12,23.27 35.79,23.6 35.79,25.27 34.82,26.24 32.89,26.24 30.86,24.21 29.44,24.21 29.08,23.85 26.04,23.85 24.51,22.33 U3.34
N$9
  Top 0.254: JTAG1.9 42.39,17.78 42.42,17.8 42.42,21.79 39.78,21.79 39.22,22.35 39.22,23.14 39.24,23.16 38.48,23.93 37.06,23.93 36.75,24.23 36.75,26.21 36.14,26.82 36.14,28.4 35.46,29.08 21.92,29.08 21.08,28.25 U3.37
N$10  (via drill 0.5)
  Top 0.254: v16.59,23.47 U3.46 16.59,26.34 14.1,28.83 v13.31,28.83 | C19.2 45.2,19.32 44.86,19.66 44.86,27.41 44.81,27.41 39.5,32.72 27.3,32.72 26.85,33.17 22.71,33.17 D1.C 18.03,32.08 17.37,31.42 v17.37,29.03
  Top 0.305: B7.3 46.51,19.32 C19.2 47.69,21.26 B7.4
  Bottom 0.254: U1.19 16.6,23.43 v16.59,23.47 | v13.31,28.83 13.66,29.18 17.22,29.18 v17.37,29.03
N$11
  Top 0.254: R9.2 41.62,11.87 41.17,11.43 39.98,11.43 39.06,12.34 39.06,13.92 JTAG1.11
N$12
  Top 0.305: R10.2 41.7,7.62 JTAG1.17
N$13
  Top 0.406: R11.2 40.39,3.44 JTAG1.19
N$14
  Top 0.254: JP3.2 39.55,35.48 40.92,34.11 R12.1
N$15
  Top 0.254: JP4.2 40.84,39.55 42.72,39.55 43.71,38.56 43.71,36.92
  Top 0.305: 43.71,36.92 R13.1
N$16  (via drill 0.5)
  Top 0.254: U3.44 17.58,26.57 13.84,30.3 6.04,30.3 4.95,29.21 4.95,12.85 v5.21,12.6 | v44.65,6.53 44.65,3.5 42.82,1.68 19.23,1.68 18.29,2.62 v17.83,2.62 | v48.28,32.23 46.41,34.11 R12.2
  Bottom 0.254: v44.65,6.53 48.39,10.26 48.39,18.49 48.56,18.67 48.56,22.73 48.74,22.91 48.74,23.7 48.28,24.16 v48.28,32.23 | v17.83,2.62 16.76,2.62 15.11,0.96 1.73,0.96 1.22,1.47 1.22,8.61 v5.21,12.6
N$17  (via drill 0.5, 0.6)
  Top 0.254: U3.20 19.1,14.43 19.68,13.84 22.43,13.84 23.37,12.9 30.79,12.9 32,14.12 34.57,14.12 34.95,13.74 36.22,13.74 36.22,15.04 36.55,15.37 36.55,18.52 37.16,19.13 38.58,19.13 v38.81,19.36
  Top 0.305: v45.87,38.25 45.87,36.46 R13.2
  Bottom 0.254: v38.81,19.36 39.19,19.36 39.42,19.13 41.12,19.13 42.47,20.47 42.47,30.4 45.87,33.81 45.87,35.64
  Bottom 0.305: 45.87,35.64 v45.87,38.25
N$18
  Top 0.305: U3.3 10.5,22.33 10.5,23.85 Y1.2 C6.1
N$19
  Bottom 0.305: U1.2 31.21,25.43 C8.2
N$20
  Bottom 0.305: U1.3 33.93,24.93 34.54,24.32 C9.2
N$21
  Top 0.305: U3.4 9.16,21.82 R14.2
N$22
  Top 0.305: 7.78,23.89 Y1.1 | Y1.1 7.87,25.86 C7.1 | R14.1 7.33,23.44 Y1.1
N$23  (via drill 0.5, 0.6)
  Top 0.254: v21.11,20.09 21.39,20.09 21.61,20.32 U3.30 | v32.11,14.96 32.11,16.82 v32.28,16.99 | v34.01,13.28 34.44,13.28 36.52,11.2 38.99,11.2 v39.06,11.12
  Top 0.305: v29.26,14.4 31.55,14.4 v32.11,14.96
  Bottom 0.254: U1.6 32.04,23.43 32.97,22.5 32.97,17.88 32.28,17.2 v32.28,16.99 | v29.26,14.4 28.3,14.4 25.63,17.07 23.75,17.07 21.49,19.33 21.49,19.71 v21.11,20.09 | LED3.A 46.34,18.07 44.93,16.66 39.47,16.66 39.09,16.28 39.09,11.15 v39.06,11.12 | v34.01,13.28 33.78,13.28 v32.11,14.96
N$24  (via drill 0.6)
  Top 0.254: U3.15 16.59,17.3 16.33,17.55 15.44,17.55 13.79,15.9 13.79,10.9 15.65,9.04 v16.92,9.04
  Top 0.305: X2.5 17.78,9.17 17.78,9.04 v16.92,9.04
  Bottom 0.305: C16.2 17.4,7.8 16.92,8.28 v16.92,9.04
N$25  (via drill 0.6)
  Top 0.254: X2.4 17.28,11.82 17.73,12.27 17.73,12.8 18.36,13.44 22.02,13.44 22.96,12.5 31.47,12.5 v32.08,13.11
  Top 0.305: U3.31 23.8,20.83 v24.05,21.08
  Bottom 0.254: v32.08,13.11 30.63,14.55 30.63,15.06 30.53,15.16 28.47,15.16 26.11,17.53 25.12,17.53 24.05,18.59 v24.05,21.08
N$26  (via drill 0.5)
  Top 0.254: X2.3 16.78,12.87 16.92,13.01 v16.99,13.01 | v15.52,14.22 15.52,15.01 16.08,15.57 U3.14
  Bottom 0.254: v15.52,14.22 16.74,13.01 v16.99,13.01
N$27
  Top 0.254: X2.2 16.28,13.44 17.58,14.73 U3.17
N$28
  Top 0.254: X2.1 15.78,13.52 17.09,14.83 U3.16
N$29  (via drill 0.6)
  Top 0.254: U3.29 25.12,19.81 v25.4,20.09
  Bottom 0.254: v25.4,20.09 25.4,18.49 25.91,17.98 26.39,17.98 28.55,15.82 32.04,15.82 R16.1
N$30  (via drill 0.6)
  Top 0.254: U3.21 19.58,15.01 20.32,14.28 25.25,14.28 27.41,16.43 30.3,16.43 31.67,17.8 v31.67,18.39
  Bottom 0.254: U1.7 31.83,22.94 32.31,22.45 32.31,19.02 v31.67,18.39
N$31  (via drill 0.6)
  Top 0.254: U3.22 20.09,15.11 20.5,14.71 25.02,14.71 27.15,16.84 29.59,16.84 v29.92,17.17
  Bottom 0.254: U1.10 28.5,21.18 30,19.68 30,17.25 v29.92,17.17
N$32  (via drill 0.6)
  Top 0.254: U3.26 28.83,18.31 v29.08,18.57 29.08,18.8 30.61,20.32 31.89,20.32 R22.1
  Bottom 0.254: v29.08,18.57 29.08,19.94 28,21.02 U1.11
N$33  (via drill 0.6)
  Top 0.254: U3.25 27.71,17.83 v27.96,17.58 | 28.07,17.68 v27.96,17.58 | R23.1 32.49,18.07 32.49,18.82 32.05,19.25 30.66,19.25 30.02,18.62 30.02,18.26 29.64,17.88 29.46,17.88 29.16,17.58 v27.96,17.58
  Bottom 0.254: v27.96,17.58 27.96,18.57 27.99,18.57 28.37,18.95 28.37,19.96 27.5,20.83 U1.12
N$34  (via drill 0.6)
  Top 0.254: U3.27 22.58,18.85 27.1,18.85 v27.58,19.33 29.03,20.78 32.16,20.78 32.82,20.12 R21.1
  Bottom 0.254: v27.58,19.33 27.58,20.09 27,20.67 U1.13
N$35  (via drill 0.6)
  Top 0.254: U3.28 26.06,19.33 v26.52,19.79 26.52,19.86
  Top 0.305: R20.1 26.61,19.88 v26.52,19.79
  Bottom 0.254: v26.53,19.8 v26.52,19.79 26.5,19.8 U1.14
N$36  (via drill 0.6)
  Top 0.254: v12.6,23.14 12.93,22.81 14.1,22.81 U3.2
  Bottom 0.254: v12.6,23.14 12.93,22.81 21.03,22.81 22.02,21.82 25.5,21.82 U1.16
  Bottom 0.305: v12.6,23.14 12.03,23.14 R19.1
N$37
  Bottom 0.305: R15.1 44.58,21.91 LED3.C
N$38  (via drill 0.5)
  Top 0.254: U3.10 11.94,18.82 v11.4,18.29 | v11.94,14.86 11.94,14.12 13.21,12.85 13.21,10.41 16.2,7.42 16.2,6.5 16.54,6.17 v17.75,6.17 | C21.2 45.82,2.4 45.82,1.07 45.57,0.81 16.99,0.81 v16.69,1.12
  Top 0.305: C21.2 47.66,4.24 B3.3 46.96,5.36 46.35,5.97 46.35,7.66 B3.4
  Bottom 0.254: v11.4,18.29 11.4,15.39 v11.94,14.86 | v16.69,1.12 17.45,1.12 19.1,2.77 19.1,3.23 19.1,3.68 19.1,4.83 v17.75,6.17
N$39
  Bottom 0.305: U1.5 32.3,23.93 33.5,22.73 33.5,20.47 33.96,20.02 R16.2
N$40  (via drill 0.5)
  Top 0.254: U3.11 12.32,18.31 12.17,18.16 12.17,16.97 10.11,14.91 7.39,14.91 v6.88,14.4 | C18.2 2.73,24.23 3.17,23.79 v3.17,13.21
  Top 0.305: C18.2 2.73,25.61 B5.4 3.23,27.37 3.23,28.57 2.1,29.7 B5.3
  Bottom 0.254: v6.88,14.4 5.41,14.4 4.22,13.21 v3.17,13.21
N$41  (via drill 0.5)
  Top 0.254: U3.12 12.85,17.83 12.7,17.68 12.7,16.84 10.24,14.38 7.92,14.38 6.93,13.39 v6.35,13.39 | v2.08,3.71 2.08,5.35 B2.4
  Top 0.305: C20.2 2.4,12.79 3.53,11.66 3.53,8.51 | 3.53,8.51 3.53,6.8 B2.4 | B2.3 3.08,8.96 3.53,8.51
  Bottom 0.254: v6.35,13.39 6.35,11.4 6.02,11.07 4.37,11.07 1.68,8.38 1.68,4.12 v2.08,3.71
N$42  (via drill 0.5)
  Top 0.254: U3.13 15.6,16.15 14.63,15.19 v14.63,11.79 | v45.62,9.75 45.47,9.6 45.47,3.2 43.51,1.25 17.96,1.25 16.69,2.52 14.48,2.52 v14.4,2.59 | v47.98,23.44 47.03,24.4 C22.2
  Top 0.305: B4.4 46.58,28.79 46.58,27.2 47.55,26.24 B4.3 47.03,25.64 C22.2
  Bottom 0.254: v14.63,11.79 13.97,11.12 13.97,3.02 v14.4,2.59 | v45.62,9.75 45.62,16.51 48.11,19 48.11,23.32 v47.98,23.44 47.98,23.32
N$43  (via drill 0.5)
  Top 0.254: U3.41 19.1,28.25 21.46,30.61 39.9,30.61 43.38,27.13 v43.38,27.03
  Bottom 0.254: v43.38,27.03 45.35,27.03 LED2.A
N$44
  Bottom 0.305: R17.1 44.79,25.65 LED2.C
N$45
  Bottom 0.254: U1.21
  Bottom 0.305: U1.21 22,24.43 19.05,27.38 19.05,29.35 B1.4
N$46
  Bottom 0.254: 23.52,24.94 22.35,24.94 19.79,27.51 19.79,29.62 B1.3
  Bottom 0.305: U1.22 24.74,24.94 23.52,24.94
N$47
  Bottom 0.254: 19.24,31.16 B1.1
  Bottom 0.305: U$44.FEED 19.24,31.16
N$48  (via drill 0.5)
  Top 0.305: v18.21,28.22 18.85,28.85 C17.2
  Bottom 0.254: U1.20 | 17.88,30.43 B1.5
  Bottom 0.305: U1.20 21.41,23.93 18.26,27.13 18.26,28.22 v18.21,28.22 18.21,29.26 17.5,29.97 17.5,30.35 17.58,30.43 17.88,30.43
N$49
  Bottom 0.305: U1.25 25.31,26.87 24.21,26.87 22.72,28.36 R18.1
N$50
  Bottom 0.305: C26.1 30.24,30.37 30.68,29.92 32.77,29.92 33.57,30.72 X1.1
N$51
  Bottom 0.305: X1.3 30.21,28.8 C27.2
N$52
  Bottom 0.305: U1.28 27,28.35 27.74,29.08 C27.1
N$53
  Bottom 0.305: U1.27 26.5,29.96 27.23,30.68 C26.2
N$54  (via drill 0.6)
  Top 0.254: 14.15,20.34 U3.7 | JTAG1.15 40.31,10.16 | JTAG1.15 40.26,10.16 38.99,8.89 32.31,8.89 31.85,9.35 v31.85,11.35 | B6.3 47.08,11.97 C5.2 | JTAG1.15 40.89,10.16 41.76,11.02 46.93,11.02 C5.2 | C5.2 47.08,12.36 44.4,15.04 44.4,27.18 39.5,32.08 D1.A
  Top 0.305: v12.22,20.32 U3.7 | B6.3 46.76,13.55 46.76,15.06 47.71,16.01 B6.4
  Bottom 0.254: v12.22,20.32 13.28,20.32 13.84,20.88 16.15,20.88 16.59,20.45 19.63,20.45 23.44,16.64 25.43,16.64 29.36,12.7 29.39,12.7 29.64,12.45 30.76,12.45 v31.85,11.35
N$56
  pour Bottom: 20.04,33.25 20.8,33.25 20.8,32.84 20.04,32.84
N$57
  pour Bottom: 22.23,33.32 23.01,33.32 23.01,32.82 22.23,32.82
THERM
  Bottom 0.254: U6.8 8.13,4.57 JP2.2
VBAT
  Top 0.305: R3.2 12.05,10.41 R2.2 | JP2.3 7.82,4.72 10.64,4.72 11.18,5.26 11.18,7.86 R4.2 12,10.31 R2.2 | 12.1,10.36 R2.2
  Bottom 0.254: IC1.1 22.61,8.89 23.88,8.89 IC1.3
  Bottom 0.305: R7.2 15.04,13.43 15.05,13.43 15.34,13.13 15.34,10.34 15.77,9.91 16,9.91 | U6.9 7.63,5.52 7.54,5.44 7.13,5.85 U6.10
  Bottom 0.406: C2.1 15.98,4.83 | 15.98,4.83 16,4.83 16,9.91 16,9.99 IC1.1 | 15.98,4.83 15.98,2.79 14.96,1.78 8.38,1.78 JP2.3 7.54,4.45 7.54,5.44
VDD  (via drill 0.5, 0.6)
  Top 0.254: v35.41,14.96 v35.42,14.96 | C25.1 27.8,27.62 v27.76,27.66
  Top 0.305: X2.6 18.29,10.62 18.29,6.82 19.2,5.91 v20.29,5.91 | X2.6 X2.7 18.78,11.58 C15.2 | v17.35,19.33 U3.9 | 15.85,19.33 v17.35,19.33 | v17.35,19.33 15.77,20.9 15.77,23.72 15.6,23.9 U3.48 15.6,25.43 v14.86,26.16 13.86,26.16 C11.2 | v17.35,19.33 18.39,18.29 20.27,18.29 21.08,17.48 U3.24 23.13,16.36 C12.1 | X2.6 18.28,12.67 18.59,12.98 21.69,12.98 22.66,12.01 24.54,12.01 25.35,11.2 25.35,9.79 C14.1 | v17.35,19.33 17.42,19.41 17.42,21.84 18.9,23.32 U3.36 22.63,23.32 22.96,23.65 22.96,24.27 C10.1 | R20.2 29.41,22.61 v30.53,21.49 30.89,21.49 31.11,21.26 32.72,21.26 32.94,21.03 35.43,21.03 35.45,21.02 R21.2 35.42,20.09 R22.2 R23.2 v35.42,14.96 | C10.1 22.94,24.26 | C24.2 30.25,26.26 v30.76,26.77 | v27.76,27.66 v25.73,27.66 24.82,27.66 24.41,28.07 22.63,28.07 22.2,27.64 v22.2,26.09 22.2,24.99 22.24,24.99 C10.1 | JP3.1 40.69,32.23 v46.05,32.23
  Bottom 0.254: IC1.4 24.64,8.13 22.61,8.13 IC1.8 | U1.29 27.5,27.4 v27.76,27.66 | LED1.A 46.05,29.81
  Bottom 0.305: v17.35,19.33 17.96,19.94 19.46,19.94 23.42,15.98 25.32,15.98 30.33,10.97 30.33,10.43 C3.1 | U1.9 29.17,21.51 30.5,21.51 v30.53,21.49 | U1.1 29.75,26.75 | 29.75,26.75 29.75,27.14 29.49,27.41 28.07,27.41 27.81,27.66 v27.76,27.66 | v22.2,26.09 22.58,26.47 23.77,26.47 24.31,25.93 U1.24 | R19.2 10.97,26.36 12.7,28.09 14.15,28.09 14.86,27.38 v14.86,26.16 | U1.26 26,27.39 v25.73,27.66 25.54,27.85 24.62,27.85 24.46,28.02 C23.2 | 46.05,29.81 v46.05,32.23 | v30.76,26.77 29.78,26.77 29.75,26.75 | v20.29,5.91 21.66,7.29 IC1.8
  Bottom 0.406: 30.31,2.74 30.31,4.83 | 30.31,4.83 C3.1 33.12,10.41 35.41,12.7 v35.41,14.96 36.68,16.23 36.68,25.93 37.85,27.1 JTAG1.2 | C4.1 30.31,4.83 | R5.2 30.26,2.79 30.31,2.74 | JTAG1.1 JTAG1.2 | JTAG1.2 37.85,29.92 37.01,30.76 JP3.1 37.01,38.2 JP4.1 | v20.29,5.91 20.29,2.06 21.03,1.32 26.39,1.32 | 26.39,1.32 29.52,1.32 30.3,2.11 30.3,2.73 30.31,2.74 | L1.2 25.22,2.49 26.39,1.32
VIN
  Bottom 0.406: 7.05,10.41 U6.1 | U6.1 7.13,10.48 7.06,10.41 7.55,10.41 U6.2 | U6.1 7.13,13.5 7.8,14.17 7.8,16.1 5.99,17.91 JP1.P$1
  Bottom 0.61: C1.1 4.83,10.41 7.05,10.41

### Text on the board
tNames: TBX01 v1.1 / 27/08/2015 Tomasz Bialas